# Altium schematic sheet LV1.schdoc: 36V to 5V Isolated supply
size A4; Organization: UCL; Address1: Address1; Address2: Address2; Address3: Address3; Address4: Address4; DocumentNumber: 3; Revision: 2.0; SheetNumber: 3; SheetTotal: 3; Author: Samer Kilani; DrawnBy: Samer Kilani; Engineer: Samer Kilani
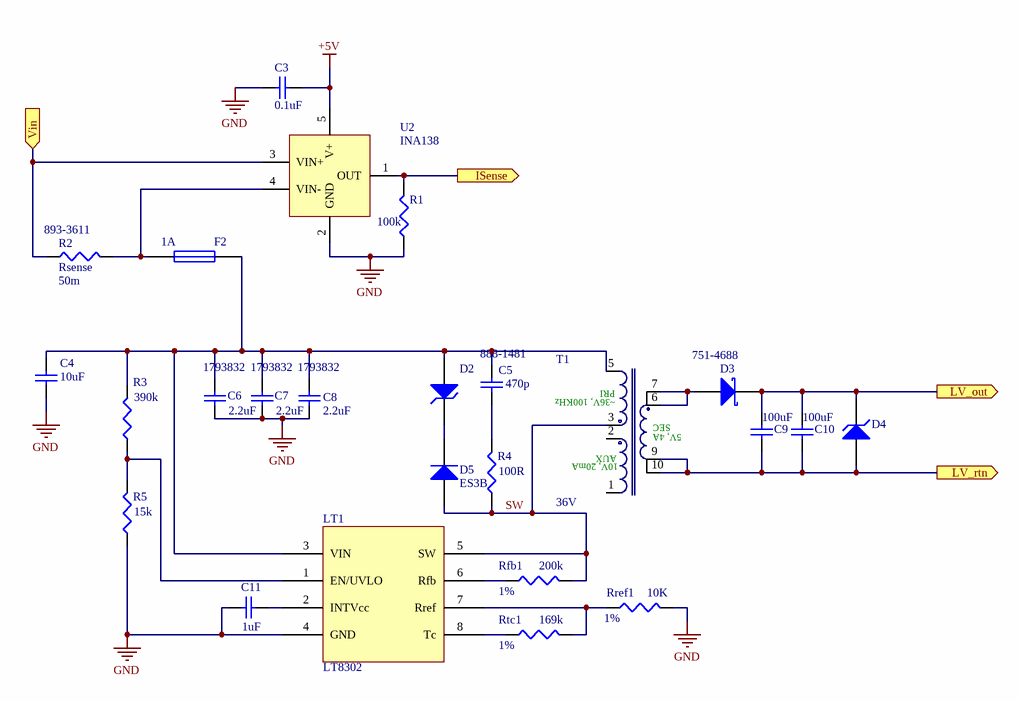
[diagram p0: LV1.schdoc]

## Parts
C3  value 0.1uF  [1608[0603]]  (hidden comment: Cap Semi)
C4  value 10uF  [C1210]  (hidden comment: Cap Semi)
C5  value 470p  Supplier Part Number 1: 888-1481  [C0805]  (hidden comment: Cap Semi)
C6  value 2.2uF  Supplier Part Number 1: 1793832  [C1210]  (hidden comment: Cap Semi)
C7  value 2.2uF  Supplier Part Number 1: 1793832  [C1210]  (hidden comment: Cap Semi)
C8  value 2.2uF  Supplier Part Number 1: 1793832  [C1210]  (hidden comment: Cap Semi)
C9  value 100uF  [C1210]  (hidden comment: Cap Semi)
C10  value 100uF  [C1210]  (hidden comment: Cap Semi)
C11  value 1uF  [1608[0603]]  (hidden comment: Cap Semi)
D2  SMAJ30A  [DO-214AC]  (value not drawn)
D3  Supplier Part Number 1: 751-4688  [PDS1040L]  (hidden comment: PDS1040L)
D4  BZT52H-B5V6  [SOD123F]  (value not drawn)
D5  ES3B  [DO-214AB]
F2  Tripping current: 1A  [MC33192]
LT1  LT8302  [S8E]
R1  value 100k  [J1-0603]  (hidden comment: Res3)
R2  Rsense  value 50m  Supplier Part Number 1: 893-3611  [R6432]
R3  value 390k  [J1-0603]  (hidden comment: Res3)
R4  value 100R  [C1206]  (hidden comment: Res3)
R5  value 15k  [J1-0603]  (hidden comment: Res3)
Rfb1  value 200k  Tolerance: 1%  [J1-0603]  (hidden comment: Res3)
Rref1  value 10K  Tolerance: 1%  [J1-0603]  (hidden comment: Res3)
Rtc1  value 169k  Tolerance: 1%  [J1-0603]  (hidden comment: Res3)
T1  36V  [EP13]
U2  INA138  [SOT-23]

## Ports
ISense (out), LV_out (out), LV_rtn (out), Vin (in)

## Nets
+5V: C3.2 U2.5(V+)
GND: C3.1 C4.1 C6.1 C7.1 C8.1 C11.2 LT1.4(GND) R1.1 R5.1 Rref1.2 U2.2(GND)
ISense: R1.2 U2.1(OUT) ; port ISense
LV_out: C9.2 C10.2 D3.2(K) D4.2(K) ; port LV_out
LV_rtn: C9.1 C10.1 D4.1(A) T1.9 T1.10 ; port LV_rtn
SW: D5.2(A) LT1.5(SW) R4.1 Rfb1.2 T1.3
Vin: R2.1 U2.3(VIN+) ; port Vin
NetC4_2: C4.2 C5.2 C6.2 C7.2 C8.2 D2.1(A) F2.2 LT1.3(VIN) R3.2 T1.5
NetC5_1: C5.1 R4.2
NetC11_1: C11.1 LT1.2(INTVcc)
NetD2_2: D2.2(K) D5.1(K)
NetD3_1: D3.1(A) T1.6 T1.7
NetF2_1: F2.1 R2.2 U2.4(VIN-)
NetLT1_1: LT1.1(EN/UVLO) R3.1 R5.2
NetLT1_6: LT1.6(Rfb) Rfb1.1
NetLT1_7: LT1.7(Rref) Rref1.1 Rtc1.2
NetLT1_8: LT1.8(Tc) Rtc1.1

Not connected (* = marked no-connect by the designer): T1 1 2

## Notes on the sheet
- (in symbol WE-FB, 750311457) PRI; ~36V, 100KHz; SEC; 5V, 4A; AUX; 10V, 20mA

## Library data of the parts
C3 = Cap Semi: Capacitor (Semiconductor SIM Model); PartNo: CC0603KRX7R9BB104; Published: 8-Jun-2000; LatestRevisionDate: 29-May-2009; LatestRevisionNote: IPC-7351 Footprint Added.; PackageReference: C1206; Publisher: Altium Limited; PackageDescription: Chip Capacitor
C4 = Cap Semi: Capacitor (Semiconductor SIM Model); PartNo: GRM32ER61H106KA12L; Published: 8-Jun-2000; LatestRevisionDate: 29-May-2009; LatestRevisionNote: IPC-7351 Footprint Added.; PackageReference: C1206; Publisher: Altium Limited; PackageDescription: Chip Capacitor
C5 = Cap Semi: Capacitor (Semiconductor SIM Model); PartNo: 08055A221JAT2A; Published: 8-Jun-2000; LatestRevisionDate: 29-May-2009; LatestRevisionNote: IPC-7351 Footprint Added.; PackageReference: C1206; Publisher: Altium Limited; PackageDescription: Chip Capacitor; Supplier 1: RS-Components
C6-C8 = Cap Semi: Capacitor (Semiconductor SIM Model); PartNo: C1210C225K1RACTU; Published: 8-Jun-2000; LatestRevisionDate: 29-May-2009; LatestRevisionNote: IPC-7351 Footprint Added.; PackageReference: C1206; Publisher: Altium Limited; PackageDescription: Chip Capacitor; Supplier 1: Farnell
C9 C10 = Cap Semi: Capacitor (Semiconductor SIM Model); PartNo: C3225X5R0J107M250AC; Published: 8-Jun-2000; LatestRevisionDate: 29-May-2009; LatestRevisionNote: IPC-7351 Footprint Added.; PackageReference: C1206; Publisher: Altium Limited; PackageDescription: Chip Capacitor
C11 = Cap Semi: Capacitor (Semiconductor SIM Model); PartNo: 06033D105KAT2A; Published: 8-Jun-2000; LatestRevisionDate: 29-May-2009; LatestRevisionNote: IPC-7351 Footprint Added.; PackageReference: C1206; Publisher: Altium Limited; PackageDescription: Chip Capacitor
D2 = D Zener: Zener Diode; Published: 8-Jun-2000; LatestRevisionDate: 17-Jul-2002; LatestRevisionNote: Re-released for DXP Platform.; PackageReference: DIODE-0.7; Publisher: Altium Limited; PackageDescription: Diode, Thru-Hole; 2 Leads; 0.7 in Pin Spacing; PartNo: SMAJ30A
D3 = PDS1040L: Schottky Diode; PartNo: SBR15U50SP5-13; Published: 8-Jun-2000; LatestRevisionDate: 17-Jul-2002; LatestRevisionNote: Re-released for DXP Platform.; PackageReference: SMC; Publisher: Altium Limited; Code_JEDEC: DO-214-AA; Supplier 1: RS-Components
D4 = BZT52H-B5V6: Zener Diode; pin to pad: 1>2 2>1; Published: 8-Jun-2000; LatestRevisionDate: 17-Jul-2002; LatestRevisionNote: Re-released for DXP Platform.; PackageReference: DIODE-0.7; Publisher: Altium Limited; PackageDescription: Diode, Thru-Hole; 2 Leads; 0.7 in Pin Spacing; PartNo: BZT52H-B5V6
D5 = ES3B: Power Diode; Note: Pin 2 is not connected and not drawn.; Published: 21-Mar-2003; LatestRevisionDate: 29-May-2009; LatestRevisionNote: IPC-7351 Footprint Added.; DatasheetVersion: Oct-1999; PackageVersion: Sep-2001; PackageReference: SOT-23; Publisher: Altium Limited; PackageDescription: 3-Pin SOT-23 Package 0.95 mm Pitch, 2.5 mm Lead Span; ComponentLink1Description: Manufacturer Link; ComponentLink1URL: http://www.infineon.com/; ComponentLink2Description: Datasheet; ComponentLink2URL: http://www.infineon.com/upload/Document/cmc_upload/documents/080/656/bas116series.pdf; PartNo: ES3B
F2 = Fuse 1: Fuse; Published: 8-Jun-2000; LatestRevisionDate: 17-Jul-2002; LatestRevisionNote: Re-released for DXP Platform.; PackageReference: PIN-W2/E2.8; Publisher: Altium Limited; PackageDescription: Thru-Hole; 2 Leads; PartNo: MC33192
LT1 = LT8302: PartNo: LT8302ES8E#PBF
R1 R3 R5 Rfb1 Rref1 Rtc1 = Res3: Resistor; Published: 8-Jun-2000; LatestRevisionDate: 29-May-2009; LatestRevisionNote: IPC-7351 Footprint Added.; PackageReference: J1-0603; Publisher: Altium Limited; PackageDescription: Chip Resistor
R2 = Rsense: CRF2512-FV-R001ELF; PartNo: MCS3264R050FER; Published: 8-Jun-2000; LatestRevisionDate: 29-May-2009; LatestRevisionNote: IPC-7351 Footprint Added.; PackageReference: J1-0603; Publisher: Altium Limited; PackageDescription: Chip Resistor; Supplier 1: RS-Components
R4 = Res3: Resistor; PartNo: CRS1206-FX-1000ELF; Published: 8-Jun-2000; LatestRevisionDate: 29-May-2009; LatestRevisionNote: IPC-7351 Footprint Added.; PackageReference: J1-1206; Publisher: Altium Limited; PackageDescription: Chip Resistor
T1 = WE-FB, 750311457: Flyback Transformer suitable or LT3573/ LT3574/ LT3575/ LT3748 WE-FB, Ui=36V; Manufacturer: Würth Elektronik eiSos GmbH; PartNo: 750311457; Ui: 36V; ComponentLink1Description: Manufacturer; ComponentLink1URL: http://www.we-online.de; Created by: Otto Christin; Created Date: OCT 2013; ComponentLink2Description: Datasheet; ComponentLink2URL: http://katalog.we-online.de/pbs/datasheet/750311457.pdf
U2 = INA138: PartNo: INA138NA/250